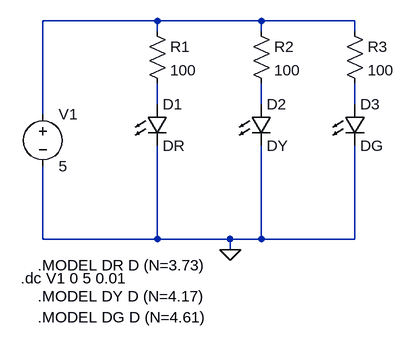
[diagram p0: schematic Versuch3_Lab1.asc]
Versuch3_Lab1.asc, the LTspice schematic file:
Version 4
SHEET 1 880 680
WIRE 240 -64 64 -64
WIRE 400 -64 240 -64
WIRE 544 -64 400 -64
WIRE 240 -48 240 -64
WIRE 400 -48 400 -64
WIRE 544 -48 544 -64
WIRE 240 64 240 32
WIRE 400 64 400 32
WIRE 544 64 544 32
WIRE 64 80 64 -64
WIRE 64 272 64 160
WIRE 240 272 240 128
WIRE 240 272 64 272
WIRE 352 272 240 272
WIRE 400 272 400 128
WIRE 400 272 352 272
WIRE 544 272 544 128
WIRE 544 272 400 272
WIRE 352 288 352 272
FLAG 352 288 0
SYMBOL res 224 -64 R0
SYMATTR InstName R1
SYMATTR Value 100
SYMBOL res 384 -64 R0
SYMATTR InstName R2
SYMATTR Value 100
SYMBOL res 528 -64 R0
SYMATTR InstName R3
SYMATTR Value 100
SYMBOL LED 224 64 R0
SYMATTR InstName D1
SYMATTR Value DR
SYMBOL LED 384 64 R0
SYMATTR InstName D2
SYMATTR Value DY
SYMBOL LED 528 64 R0
SYMATTR InstName D3
SYMATTR Value DG
SYMBOL voltage 64 64 R0
WINDOW 123 0 0 Left 0
WINDOW 39 0 0 Left 0
SYMATTR InstName V1
SYMATTR Value 5
TEXT 56 312 Left 2 !.MODEL DR D (N=3.73)
TEXT 30 332 Left 2 !.dc V1 0 5 0.01
TEXT 56 360 Left 2 !.MODEL DY D (N=4.17)
TEXT 56 392 Left 2 !.MODEL DG D (N=4.61)

The netlist it stands for:
* Versuch3_Lab1.asc
R1 N001 N002 100
R2 N001 N003 100
R3 N001 N004 100
D1 N002 0 DR
D2 N003 0 DY
D3 N004 0 DG
V1 N001 0 5
.model D D
.lib standard.dio
.MODEL DR D (N=3.73)
.dc V1 0 5 0.01
.MODEL DY D (N=4.17)
.MODEL DG D (N=4.61)
.backanno
.end